# Altium schematic sheet MCU.SchDoc
size A; SheetNumber: 2
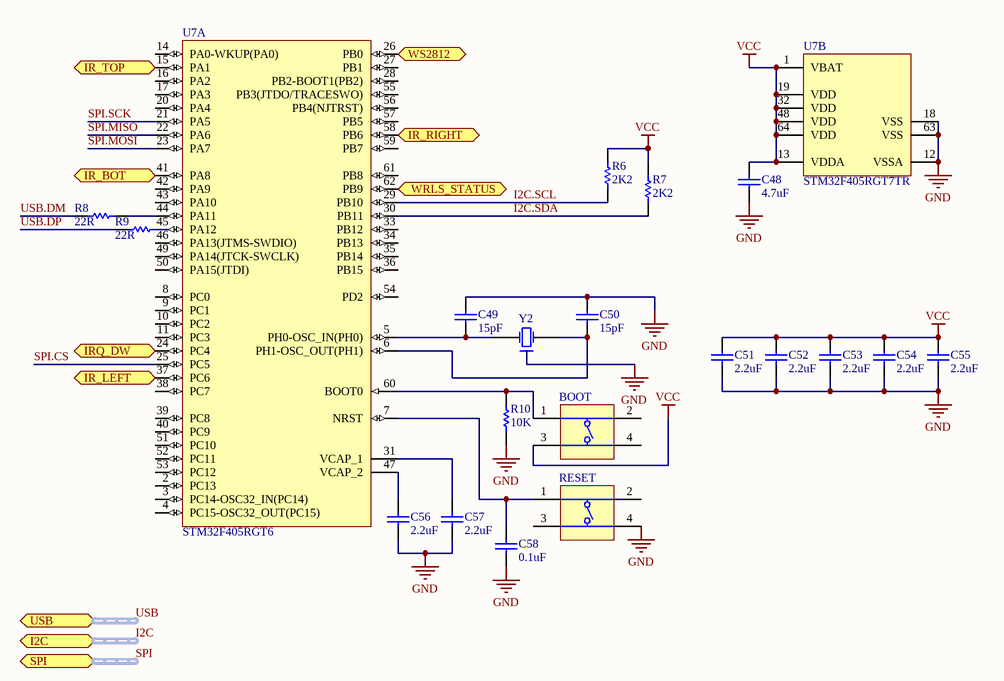
[diagram p0: MCU.SchDoc]

## Parts
BOOT  (no value)  [SWITCH]
C48  value 4.7uF  [C0402[1005X55]]  (hidden comment: 4.7uF 6.3V 0402)
C49  value 15pF  [C0402[1005X55]]  (hidden comment: 15pF 50V 0402)
C50  value 15pF  [C0402[1005X55]]  (hidden comment: 15pF 50V 0402)
C51  value 2.2uF  [C0402[1005X55]]  (hidden comment: 2.2uF 6.3V 0402)
C52  value 2.2uF  [C0402[1005X55]]  (hidden comment: 2.2uF 6.3V 0402)
C53  value 2.2uF  [C0402[1005X55]]  (hidden comment: 2.2uF 6.3V 0402)
C54  value 2.2uF  [C0402[1005X55]]  (hidden comment: 2.2uF 6.3V 0402)
C55  value 2.2uF  [C0402[1005X55]]  (hidden comment: 2.2uF 6.3V 0402)
C56  value 2.2uF  [C0402[1005X55]]  (hidden comment: 2.2uF 6.3V 0402)
C57  value 2.2uF  [C0402[1005X55]]  (hidden comment: 2.2uF 6.3V 0402)
C58  value 0.1uF  [C0402[1005X55]]  (hidden comment: 0.1uF 6.3V 0402)
R6  value 2K2  [R0402[1005]]  (hidden comment: 2K2 1% 0402)
R7  value 2K2  [R0402[1005]]  (hidden comment: 2K2 1% 0402)
R8  value 22R  [R0402[1005]]  (hidden comment: 22R 1% 0402)
R9  value 22R  [R0402[1005]]  (hidden comment: 22R 1% 0402)
R10  value 10K  [R0402[1005]]  (hidden comment: 10K 1% 0402)
RESET  (no value)  [SWITCH]
U7  STM32F405RGT6  [STM-LQFP64_L]  (parts A,B of 2)
Y2  (no value)  [ABRA-ABM3B-4_V]

## Ports
I2C (harness I2C), IR_BOT (in), IR_LEFT (in), IR_RIGHT (in), IR_TOP (in), IRQ_DW (in), SPI (harness SPI), USB (harness USB), WRLS_STATUS (in), WS2812 (out)

## Nets
GND: C48.1 C49.2 C50.2 C51.1 C52.1 C53.1 C54.1 C55.1 C56.1 C57.1 C58.1 R10.1 RESET.4(T3) U7.12(VSSA) U7.18(VSS) U7.63(VSS) Y2.2
VCC: BOOT.3(T3) C48.2 C51.2 C52.2 C53.2 C54.2 C55.2 R6.2 R7.2 U7.1(VBAT) U7.13(VDDA) U7.19(VDD) U7.32(VDD) U7.48(VDD) U7.64(VDD)
I2C.SCL: R6.1 U7.29(PB10)
I2C.SDA: R7.1 U7.30(PB11)
IR_BOT: U7.41(PA8) ; port IR_BOT
IR_LEFT: U7.37(PC6) ; port IR_LEFT
IR_RIGHT: U7.58(PB6) ; port IR_RIGHT
IR_TOP: U7.15(PA1) ; port IR_TOP
IRQ_DW: U7.24(PC4) ; port IRQ_DW
SPI.CS: U7.25(PC5)
SPI.MISO: U7.22(PA6)
SPI.MOSI: U7.23(PA7)
SPI.SCK: U7.21(PA5)
USB.DM: R8.1
USB.DP: R9.1
WRLS_STATUS: U7.62(PB9) ; port WRLS_STATUS
WS2812: U7.26(PB0) ; port WS2812
NetBOOT_1: BOOT.1(T1) R10.2 U7.60(BOOT0)
NetC49_1: C49.1 U7.5(PH0-OSC_IN(PH0)) Y2.3(X2)
NetC50_1: C50.1 U7.6(PH1-OSC_OUT(PH1)) Y2.1(X1)
NetC56_2: C56.2 U7.47(VCAP_2)
NetC57_2: C57.2 U7.31(VCAP_1)
NetC58_2: C58.2 RESET.1(T1) U7.7(NRST)
NetR8_2: R8.2 U7.44(PA11)
NetR9_2: R9.2 U7.45(PA12)

Not connected (* = marked no-connect by the designer): BOOT 2(T2) 4(T3); RESET 2(T2) 3(T3); U7 2(PC13) 3(PC14-OSC32_IN(PC14)) 4(PC15-OSC32_OUT(PC15)) 8(PC0) 9(PC1) 10(PC2) 11(PC3) 14(PA0-WKUP(PA0)) 16(PA2) 17(PA3) 20(PA4) 27(PB1) 28(PB2-BOOT1(PB2)) 33(PB12) 34(PB13) 35(PB14) 36(PB15) 38(PC7) 39(PC8) 40(PC9) 42(PA9) 43(PA10) 46(PA13(JTMS-SWDIO)) 49(PA14(JTCK-SWCLK)) 50(PA15(JTDI)) 51(PC10) 52(PC11) 53(PC12) 54(PD2) 55(PB3(JTDO/TRACESWO)) 56(PB4(NJTRST)) 57(PB5) 59(PB7) 61(PB8)

## Buses and harness runs
harness I2C = port I2C
harness SPI = port SPI
harness USB = port USB

## Library data of the parts
BOOT RESET = DIPT-DTSM-6: Switch, SPNO Push Button SMD; Manufacturer: C&K Components; PartNumber: PTS810 SJM 250 SMTR LFS; Packing Type: Tape&Reel; Mechanical Life: 200,000 cycles; ComponentLink2URL: http://www.dip.com.tw/Products_tact.htm; ComponentLink1URL: http://www.dip.com.tw/; ComponentLink3URL: http://www.dip.com.tw/PDF/pro_tact/DTSM_G_-6_2_-V.pdf; PackageDescription: Switch, Surface Mount, 4 Leads, Body 4.6x2.8mm, Height 1.9mm; ComponentLink2Description: Datasheet; ComponentLink3Description: Package Specification; ComponentLink1Description: Manufacturer URL; PackageReference: PTS810; Mounting Technology: Surface Mount
C48 = CAP_4.7uF_6.3V_0402_20%: 4.7uF 6.3V 20% 0402 (1005 Metric); PartNumber: GRM155R60J475ME47D; Manufacturer: Murata; Tolerance: 20%; Mounting Technology: Surface Mount; PackageReference: 0402; PackageDescription: 0402 (1005 Metric); Voltage: 6.3V
C49 C50 = CAP_15pF_50V_0402_5%: 15pF 50V 5% 0402 (1005 Metric); PartNumber: GRM1555C1H150JA01D; Manufacturer: Murata; Tolerance: 5%; Mounting Technology: Surface Mount; PackageReference: 0402; PackageDescription: 0402 (1005 Metric); Voltage: 50V
C51-C57 = CAP_2.2uF_6.3V_0402_20%: 2.2uF 6.3V 20% 0402 (1005 Metric); PartNumber: GRM155R60J225ME15D; Manufacturer: Murata; Tolerance: 20%; Mounting Technology: Surface Mount; PackageReference: 0402; PackageDescription: 0402 (1005 Metric); Voltage: 6.3V
C58 = CAP_0.1uF_6.3V_0402_10%: 0.1uF 6.3V 10% 0402 (1005 Metric); PartNumber: GRM155R70J104KA01D; Manufacturer: Murata; Tolerance: 10%; Mounting Technology: Surface Mount; PackageReference: 0402; PackageDescription: 0402 (1005 Metric); Voltage: 6.3V
R6 R7 = RES_2K2_0402_1%: 2K2 0.063W 1% 0402 (1005 Metric); Manufacturer: KOA Speer; PartNumber: RK73H1ETTP2201F; Tolerance: 1%; Power: 0.063W; Mounting Technology: Surface Mount; PackageReference: 0402; PackageDescription: 0402 (1005 Metric); ComponentLink1Description: Datasheet; ComponentLink1URL: http://www.koaspeer.com/catimages/Products/RK73H/RK73H.pdf
R8 R9 = RES_22R_0402_1%: 22R 0.063W 1% 0402 (1005 Metric); Manufacturer: KOA Speer; PartNumber: RK73H1ETTP22R0F; Power: 0.063W; Tolerance: 1%; Mounting Technology: Surface Mount; PackageReference: 0402; PackageDescription: 0402 (1005 Metric); ComponentLink1Description: Datasheet; ComponentLink1URL: http://www.koaspeer.com/catimages/Products/RK73H/RK73H.pdf
R10 = RES_10K_0402_1%: 10K 0.063W 1% 0402 (1005 Metric); Manufacturer: KOA Speer; PartNumber: RK73H1ETTP1002F; Tolerance: 1%; Power: 0.063W; Mounting Technology: Surface Mount; PackageReference: 0402; PackageDescription: 0402 (1005 Metric); ComponentLink1Description: Datasheet; ComponentLink1URL: http://www.koaspeer.com/catimages/Products/RK73H/RK73H.pdf
U7 = CMP-0243-00089-2: ARM Cortex-M4 32-bit MCU+FPU, 210 DMIPS, 1024 kB Flash, 192 kB Internal RAM, 51 I/Os, 64-pin LQFP, -40 to 105 degC, Tape and Reel; Manufacturer: STMicroelectronics; FLASH Size (Prog) (kB): 1024; Supply Voltage(Vcc) max (V): 3.6; Internal RAM Size (kB): 192; Supply Voltage(Vcc) min (V): 1.8; Operating Frequency(F) (Processor speed) (MHz): 168; D/A Converter: 2x12-bit; I/Os (High Current): 51; ComponentLink2Description: Datasheet; Core: ARM Cortex-M4; PackageVersion: Rev. 4, 06/2013; ComponentLink1URL: http://www.st.com/web/en/home.html; PackageReference: LQFP64; Mounting Technology: Surface Mount; ComponentLink1Description: Manufacturer URL; PackageDescription: 64-Pin Low Profile Quad Flat Package, 10 x 10 mm Body, 0.5 mm Pitch; ComponentLink3Description: Package Specification; ComponentLink2URL: http://www.st.com/st-web-ui/static/active/en/resource/technical/document/datasheet/DM00037051.pdf; PartNumber: STM32F405RGT6; ComponentLink3URL: http://www.st.com/st-web-ui/static/active/en/resource/technical/document/datasheet/DM00037051.pdf; Packing: Tape and Reel; DatasheetVersion: Rev. 4; PartId: 1
Y2 = ABRA-ABM3B-4: PartNumber: ABM3B-8.000MHZ-10-1UT; Manufacturer: ABRACON; Mounting Technology: Surface Mount; PackageReference: 2012; PackageDescription: 2012 (5032 metric)